# EAGLE design piezo-preamp-tickler_V3-4_single-supply-OPA1642_Labels (EAGLE 8.5.0)

## Sheet 1 of 2
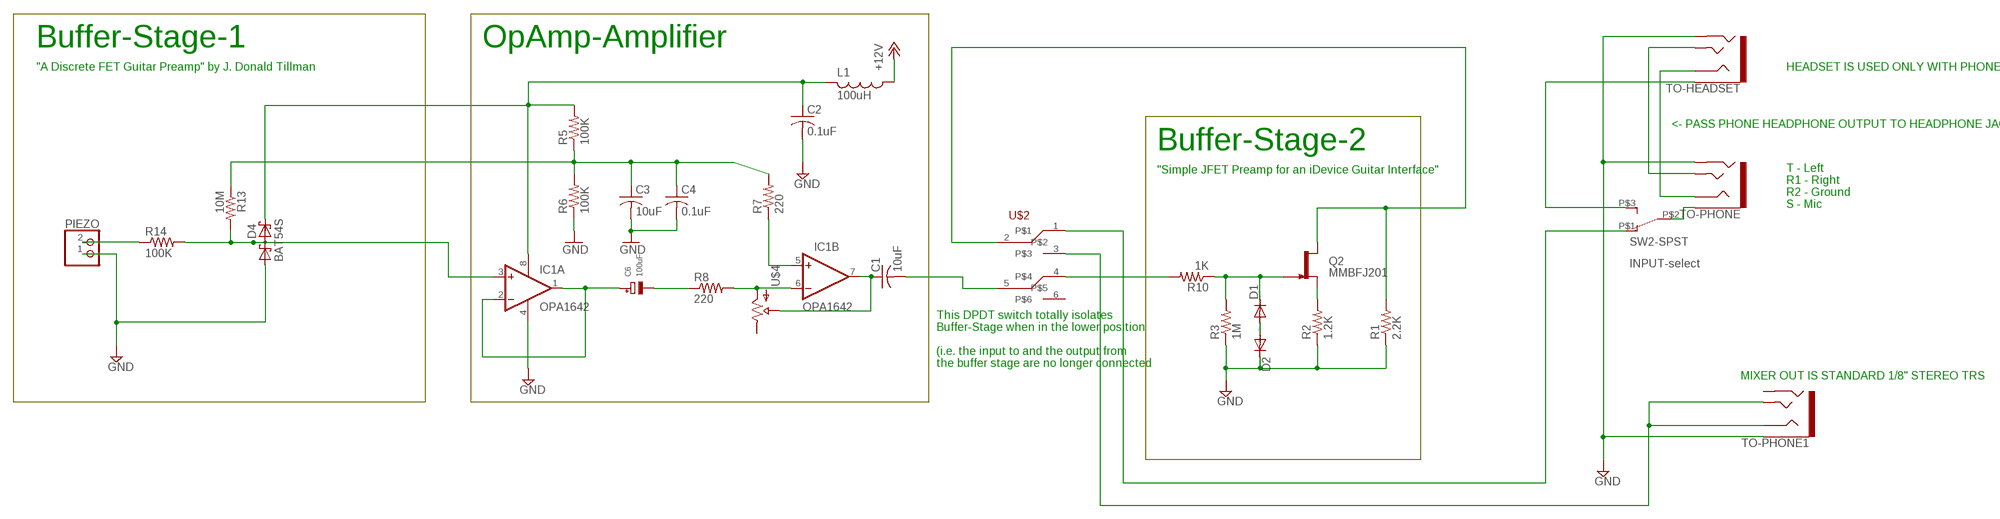
[diagram p0: schematic, sheet 1]

### Parts
C1  10uF  C-USC0603  [C0603]
C2  0.1uF  C-USC0805K  [C0805K]
C3  10uF  C-USC0805K  [C0805K]
C4  0.1uF  C-USC0805K  [C0805K]
C6  100uF  CAP_TANTALUMA/3216_REFLOW  [EIA3216-18/A-R]
D1  DIODE-SOD123  [SOD123]
D2  DIODE-SOD123  [SOD123]
D4  BAT54S  [SOT23]
IC1  OPA1642  OPA2134UA  [SO08]
L1  100uH  L-USL3225P  [L3225P]
PIEZO  JST_2PIN-THM  [JST-PH-2-THM]
Q2  MMBFJ201  J201SOT-23  [SOT23-3]
R1  2.2K  R-US_R0603  [R0603]
R2  1.2K  R-US_R0603  [R0603]
R3  1M  R-US_R0603  [R0603]
R5  100K  R-US_R0603  [R0603]
R6  100K  R-US_R0603  [R0603]
R7  220  R-US_R0603  [R0603]
R8  220  R-US_R0603  [R0603]
R10  1K  R-US_R0603  [R0603]
R13  10M  R-US_R0603  [R0603]
R14  100K  R-US_R0603  [R0603]
SW2-SPST  INPUT-select  SWITCH_SPDTCL-SB-12B  [SWITCH_SPDT_CL-SB-12B]
TO-HEADSET  AUDIO-JACK3LGPADS  [AUDIO-JACK-TRRS-SMD]
TO-PHONE  AUDIO-JACK3LGPADS  [AUDIO-JACK-TRRS-SMD]
TO-PHONE1  AUDIO-JACK3LGPADS  [AUDIO-JACK-TRRS-SMD]
U$2  SWITCH_DPDT  [SWITCH_DPDT_CL-SB-22B]
U$4  POTPOT-THUMB-ALPHA  [POT-THUMB-14MM_ALPHA-RV100F-30-4K1B-B10K-B301]

### Nets
+12V: L1.1 ; also sheet 2
GND: C2.2 C3.2 C4.2 D2.C D4.1(A1) IC1.4(A:V-) PIEZO.1 R1.1 R2.1 R3.1 R6.1 TO-HEADSET.RING2 TO-PHONE1.EARTH TO-PHONE.RING2 ; also sheet 2
N$1: D1.A D2.A
N$2: PIEZO.2 R14.1
N$3: Q2.2(S) R2.2
N$4: TO-HEADSET.EARTH
N$5: IC1.5(B:+IN) R7.1
N$6: C1.1 IC1.7(B:OUT) U$4.P$3(WIPER)
N$7: IC1.6(B:-IN) R8.2 U$4.P$1(IN)
N$9: D4.3(C1A2) IC1.3(A:+IN) R13.2 R14.2
N$10: D1.C Q2.3(G) R3.2 R10.1
N$11: R10.2 U$2.4
N$12: TO-PHONE1.RING1 TO-PHONE1.TIP U$2.3
N$13: TO-HEADSET.TIP TO-PHONE.TIP
N$14: C6.- R8.1
N$15: TO-HEADSET.RING1 TO-PHONE.RING1
N$16: C1.2 U$2.5
N$17: SW2-SPST.P$2 TO-PHONE.EARTH
N$19: SW2-SPST.P$1 U$2.1
N$23: C3.1 C4.1 R5.1 R6.2 R7.2 R13.1
N$24: C6.+ IC1.1(A:OUT) IC1.2(A:-IN)
N$25: C2.1 D4.2(C2) IC1.8(A:V+) L1.2 R5.2
SELECT: Q2.1(D) R1.2 U$2.2
Unconnected: SW2-SPST.P$3 TO-PHONE1.RING2 U$2.6 U$4.P$2(OUT)

### Notes on the sheet
- Buffer-Stage-1 | OpAmp-Amplifier
- "A Discrete FET Guitar Preamp" by J. Donald Tillman | HEADSET IS USED ONLY WITH PHONE
- <- PASS PHONE HEADPHONE OUTPUT TO HEADPHONE JACK
- Buffer-Stage-2
- "Simple JFET Preamp for an iDevice Guitar Interface"
- T - Left
  R1 - Right
  R2 - Ground
  S - Mic
- This DPDT switch totally isolates 
  Buffer-Stage when in the lower position
  
  (i.e. the input to and the output from 
  the buffer stage are no longer connected
- MIXER OUT IS STANDARD 1/8" STEREO TRS

## Sheet 2 of 2
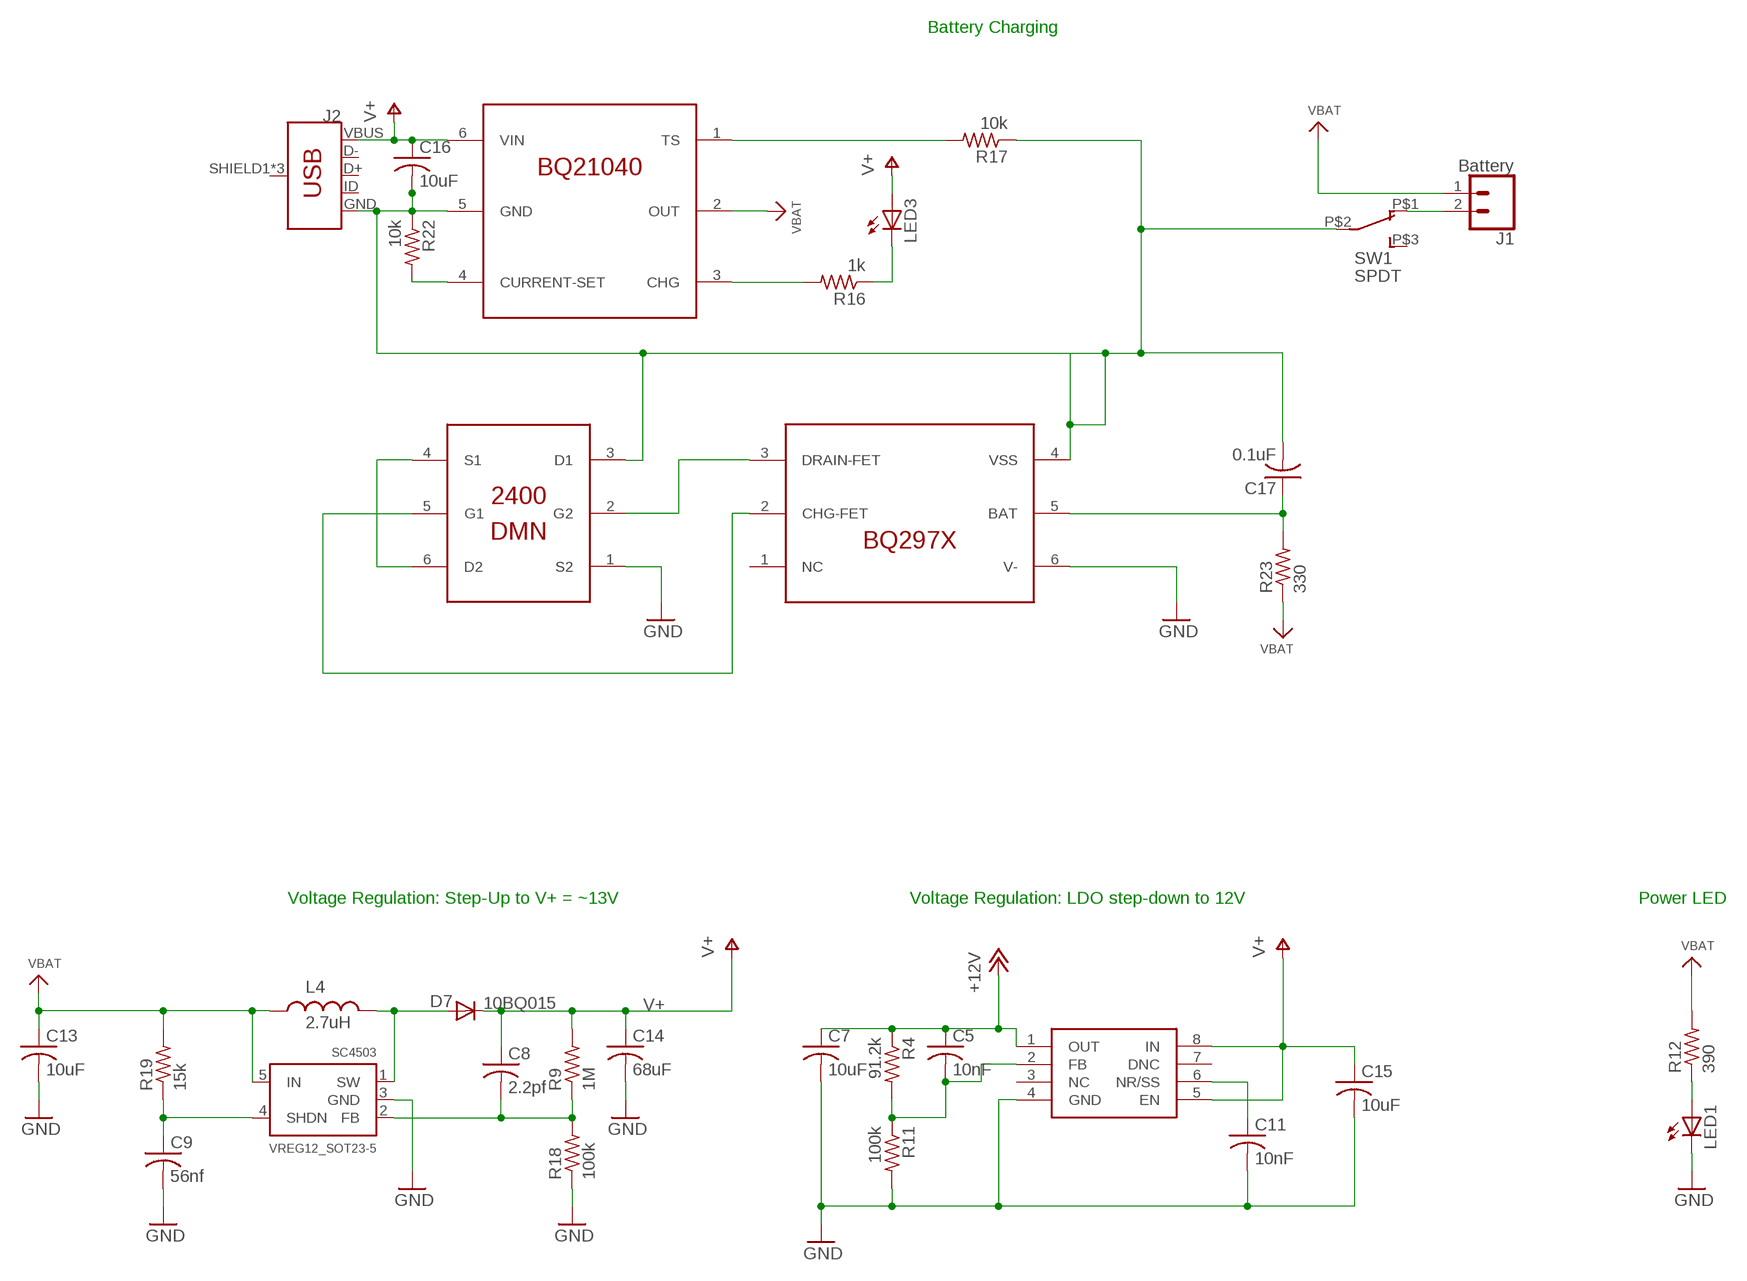
[diagram p1: schematic, sheet 2]

### Parts
C5  10nF  C-USC0603  [C0603]
C7  10uF  C-USC0603  [C0603]
C8  2.2pf  C-USC0805  [C0805]
C9  56nf  C-USC0805  [C0805]
C11  10nF  C-USC0603  [C0603]
C13  10uF  C-USC0805  [C0805]
C14  68uF  C-USC0805  [C0805]
C15  10uF  C-USC0603  [C0603]
C16  10uF  C-USC0805K  [C0805K]
C17  0.1uF  C-USC0805K  [C0805K]
D7  10BQ015  DIODESMA  [SMA-DIODE]
J1  Battery  CONN_02LOCK  [1X02_LOCK]
J2  USB_MICRO-BREDUCED_PASTE  [USB-B-MICRO-SMD_RED_PASTE]
L4  2.7uH  INDUCTORCR54  [CR54]
LED1  LED3MM  [LED3MM]
LED3  LED3MM  [LED3MM]
Q1  BQ21040  BQ21040-LIPO-CHARGER  [SOT23-6]
Q5  BQ297X  BQ297X-BATTERY-MANAGER  [WSON-6]
Q7  DMN2400  DUAL-NFET-DMN2400  [SOT-563]
R4  91.2k  R-US_R0603  [R0603]
R9  1M  R-US_R0603  [R0603]
R11  100k  R-US_R0603  [R0603]
R12  390  R-US_R0805  [R0805]
R16  1k  R-US_R0805  [R0805]
R17  10k  R-US_R0805  [R0805]
R18  100k  R-US_R0603  [R0603]
R19  15k  R-US_R0603  [R0603]
R22  10k  R-US_R0805  [R0805]
R23  330  R-US_R0805  [R0805]
SC4503  VREG12_SOT23-5  [SOT23-5]
SW1  SPDT  SWITCH_SPDTCL-SB-12B  [SWITCH_SPDT_CL-SB-12B]
U$5  TPS7A49  [MSOP-8]

### Nets
+12V: C5.1 C7.1 R4.1 U$5.1(OUT) ; also sheet 1
GND: C7.2 C9.2 C11.2 C13.2 C14.2 C15.2 LED1.K(C) Q5.6(V-) Q7.1(S2) R11.2 R18.1 SC4503.3(GND) U$5.4(GND) ; also sheet 1
GND2: C16.2 C17.2 J2.GND Q1.5(GND) Q5.4(VSS) Q7.3(D1) R17.1 R22.1 SW1.P$2
N$18: LED1.A R12.1
N$20: J1.2 SW1.P$1
N$22: LED3.K(C) R16.1
N$26: C5.2 R4.2 R11.1 U$5.2(FB)
N$27: Q1.3(CHG) R16.2
N$28: C11.1 U$5.6(NR/SS)
N$29: C9.1 R19.1 SC4503.4(SHDN)
N$30: C8.2 R9.1 R18.2 SC4503.2(FB)
N$31: Q1.1(TS) R17.2
N$32: D7.A L4.P$2 SC4503.1(SW)
N$36: Q1.4(CURRENT-SET) R22.2
N$42: C17.1 Q5.5(BAT) R23.2
N$43: Q7.4(S1) Q7.6(D2)
N$44: Q5.2(CHG-FET) Q7.5(G1)
N$45: Q5.3(DRAIN-FET) Q7.2(G2)
V+: C8.1 C14.1 C15.1 C16.1 D7.C J2.VBUS LED3.A Q1.6(VIN) R9.2 U$5.5(EN) U$5.8(IN)
VBAT: C13.1 J1.1 L4.P$1 Q1.2(OUT) R12.2 R19.2 R23.1 SC4503.5(IN)
Unconnected: J2.D+ J2.D- J2.ID J2.SHIELD1(SHIELD) J2.SHIELD2(SHIELD) J2.SHIELD3(SHIELD) Q5.1(NC) SW1.P$3 U$5.3(NC) U$5.7(DNC)

### Notes on the sheet
- Battery Charging
- Voltage Regulation: Step-Up to V+ = ~13V | Voltage Regulation: LDO step-down to 12V | Power LED

## Library data of the parts
C1-C5 C7-C9 C11 C13-C17 = adafruit:C-US: CAPACITOR, American symbol
C6 = microbuilder:CAP_TANTALUM: Tantalum Capacitors Wave footprints have larger pads and are meant to be used for hand soldering. Reflow footprints are optimised for solder paste and a reflow oven. EIA3216-18/A-[R/W] - Size A / 3216-18 / 1206 footprint 4.7µF 25V 10% Tantalum Capacitor 10µF 16V 10% Tantalum Capacitor [Digikey: 495-2236-2-ND] EIA3528-21/B-[R/W] - Size B / 3528-21 47µF 10V 10% Tantalum Capactior [Digikey: 495-2216-1-ND] EIA6032-28/C-[R/W] - Size C / 6032-28 10µF 35V 20% Tantalum Capacitor [Digikey: 495-2285-1-ND] 100µF 16V 10% Tantalum Capactior [Digikey: 399-5214-1-ND]
D1 D2 = diode:DIODE-: DIODE
D4 = diode:BAT54S: Schottky Diodes Pin connection corrected 2011-05-04 Source: Fairchild .. BAT54.pdf
D7 = SparkFun:DIODE: Diode These are standard reverse protection diodes and small signal diodes. SMA package can handle up to about 1A. SOD-323 can handle about 200mA. What the SOD-323 package when ordering, there are some mfgs out there that are 5-pin packages.
IC1 = linear:OPA2*: Dual Operational Amplifier Low Power, Single-Supply, Rail-To-Rail Operational Amplifier Source: http://focus.ti.com/lit/ds/symlink/opa2345.pdf http://focus.ti.com .. opa241.pdf http://focus.ti.com/lit/ds/symlink/opa2134.pdf
J1 = SparkFun-Connectors:CONN_02: Multi connection point. Often used as Generic Header-pin footprint for 0.1 inch spaced/style header connections On any of the 0.1 inch spaced packages, you can populate with these: Break Away Headers - Straight <https://www.sparkfun.com/products/116> (PRT-00116) Break Away Male Headers - Right Angle <https://www.sparkfun.com/products/553> (PRT-00553) Female Headers <https://www.sparkfun.com/products/115> (PRT-00115) Break Away Headers - Machine Pin <https://www.sparkfun.com/products/117> (PRT-00117) Break Away Female Headers - Swiss Machine Pin <https://www.sparkfun.com/products/743> (PRT-00743) For SCREWTERMINALS and SPRING TERMINALS visit here: Screw Terimnals on SparkFun.com <https://www.sparkfun.com/search/results?term=Screw+Terminals> (5mm/3.5mm/2.54mm spacing) This device is also useful as a general connection point to wire up your design to another part of your project. Our various solder wires solder well into these plated through hole pads. Hook-Up Wire - Assortment (Stranded, 22 AWG) <https://www.sparkfun.com/products/11375> (PRT-11375) Hook-Up Wire - Assortment (Solid Core, 22 AWG) <https://www.sparkfun.com/products/11367> (PRT-11367) View the entire wire category on our website here <https://www.sparkfun.com/categories/141> Special notes: Molex polarized connector foot print use with: PRT-08233 with associated crimp pins and housings. 2.54_SCREWTERM for use with PRT-10571. 3.5mm Screw Terminal footprints for PRT-08084 5mm Screw Terminal footprints for use with PRT-08432
J2 = SparkFun-Connectors:USB_MICRO-B: USB Type Micro-B Connector Male/female and PTH/SMT variants SparkFun Products: SparkFun microB USB Breakout <https://www.sparkfun.com/products/12035> SparkFun USB microB Plug Breakout <https://www.sparkfun.com/products/10031> SparkFun ESP8266 Thing <https://www.sparkfun.com/products/13231>; PROD_ID: CONN-11752
L1 = rcl:L-US: INDUCTOR, American symbol; SPICEPREFIX: L
L4 = SparkFun:INDUCTOR: Inductors Basic Inductor/Choke - 0603 and 1206. Footprints are not proven and vary greatly between part numbers.
LED1 LED3 = led:LED: LED OSRAM: - CHIPLED LG R971, LG N971, LY N971, LG Q971, LY Q971, LO R971, LY R971 LH N974, LH R974 LS Q976, LO Q976, LY Q976 LO Q996 - Hyper CHIPLED LW Q18S LB Q993, LB Q99A, LB R99A - SideLED LS A670, LO A670, LY A670, LG A670, LP A670 LB A673, LV A673, LT A673, LW A673 LH A674 LY A675 LS A676, LA A676, LO A676, LY A676, LW A676 LS A679, LY A679, LG A679 - Hyper Micro SIDELED® LS Y876, LA Y876, LO Y876, LY Y876 LT Y87S - SmartLED LW L88C, LW L88S LB L89C, LB L89S, LG L890 LS L89K, LO L89K, LY L89K LS L896, LA L896, LO L896, LY L896 - TOPLED LS T670, LO T670, LY T670, LG T670, LP T670 LSG T670, LSP T670, LSY T670, LOP T670, LYG T670 LG T671, LOG T671, LSG T671 LB T673, LV T673, LT T673, LW T673 LH T674 LS T676, LA T676, LO T676, LY T676, LB T676, LH T676, LSB T676, LW T676 LB T67C, LV T67C, LT T67C, LS T67K, LO T67K, LY T67K, LW E67C LS E67B, LA E67B, LO E67B, LY E67B, LB E67C, LV E67C, LT E67C LW T67C LS T679, LY T679, LG T679 LS T770, LO T770, LY T770, LG T770, LP T770 LB T773, LV T773, LT T773, LW T773 LH T774 LS E675, LA E675, LY E675, LS T675 LS T776, LA T776, LO T776, LY T776, LB T776 LHGB T686 LT T68C, LB T68C - Hyper Mini TOPLED® LB M676 - Mini TOPLED Santana® LG M470 LS M47K, LO M47K, LY M47K Source: http://www.osram.convergy.de LUXEON: - LUMILED® LXK2-PW12-R00, LXK2-PW12-S00, LXK2-PW14-U00, LXK2-PW14-V00 LXK2-PM12-R00, LXK2-PM12-S00, LXK2-PM14-U00 LXK2-PE12-Q00, LXK2-PE12-R00, LXK2-PE12-S00, LXK2-PE14-T00, LXK2-PE14-U00 LXK2-PB12-K00, LXK2-PB12-L00, LXK2-PB12-M00, LXK2-PB14-N00, LXK2-PB14-P00, LXK2-PB14-Q00 LXK2-PR12-L00, LXK2-PR12-M00, LXK2-PR14-Q00, LXK2-PR14-R00 LXK2-PD12-Q00, LXK2-PD12-R00, LXK2-PD12-S00 LXK2-PH12-R00, LXK2-PH12-S00 LXK2-PL12-P00, LXK2-PL12-Q00, LXK2-PL12-R00 Source: www.luxeon.com KINGBRIGHT: KA-3528ASYC Source: www.kingbright.com
PIEZO = adafruit:JST_2PIN: JST 2-Pin Connectors of various flavors SMT-RA (S2B-PH-SM4) 4UConnector #17311 SMT (B2B-PH-SM4) THM-RA (S2B-PH) THM (B2B-PH)
Q1 = CMU-ArtFab:BQ21040-LIPO-CHARGER
Q2 = CMU-ArtFab:J201: N-channel JFET
Q5 = CMU-ArtFab:BQ297X-BATTERY-MANAGER
Q7 = CMU-ArtFab:DUAL-NFET-DMN2400
R1-R14 R16-R19 R22 R23 = CMU-ArtFab:R-US_: RESISTOR, American symbol
SC4503 = CMU-ArtFab:VREG12_SOT23-5: SOT23-5 Fixed Voltage Regulators To better organise some of the SOT23-5 fixed voltage regulators in this library, this new part was created. Part Current Out V Out V In V Dropout Digikey Part No. ADP121 150mA 3.3V 3.4-5.5V 0.09V @ 150mA ADP121-AUJZ33R7CT-ND ADP121 150mA 3.0V 3.1-5.5V 0.09V @ 150mA ADP121-AUJZ30R7CT-ND ADP122 300mA 3.3V 3.4-5.5V 0.085V @ 300mA ADP122AUJZ-3.3-R7CT-ND ADP1712 300mA 3.3V 3.5-5.5V 0.17V @ 300mA ADP1712AUJZ-3.3-R7TR-ND AP7311 (Low Cost) 150mA 3.3V 3.5-6V 0.15V @ 150mA AP7311-33WG-7DICT-ND LD39015M18R 150mA 1.8V 1.9V-5.5V 0.08V @ 100mA 497-6977-1-ND MCP1824T-3302E/OT 300mA 3.3V 3.5V-6V 0.2V @ 300mA MCP1824T-3302E/OTCT-ND MIC5205-2.5YM5 TR 150mA 2.5V 2.7-16V 0.165V @ 150mA 576-1257-2-ND MIC5205-3.0YM5 TR 150mA 3.0V 3.2V-16V 0.165V @ 150mA 576-1258-2-ND MIC5205-3.3YM5 TR 150mA 3.3V 3.5V-16V 0.165V @ 150mA 576-1259-2-ND TPS780330220 150mA 3.3V+2.2V 3.6-5.5V 250mV Max 296-23332-1-ND TDA3663/N1,135 100mA 3.3V 3.5-45V 0.18V @ 50mA 568-5343-1-ND
SW1 SW2-SPST = CMU-ArtFab:SWITCH_SPDT
TO-HEADSET TO-PHONE TO-PHONE1 = Daniel:AUDIO-JACK3: Audio jack - 3.5mm TRRS variety - two rings.
U$2 = CMU-ArtFab:SWITCH_DPDT
U$4 = CMU-ArtFab:POT: http://www.taydaelectronics.com/10k-ohm-linear-taper-potentiometer-round-shaft-pcb-9mm.html http://www.taydaelectronics.com/datasheets/A-1847.pdf
U$5 = CMU-ArtFab:TPS7A49

## Board
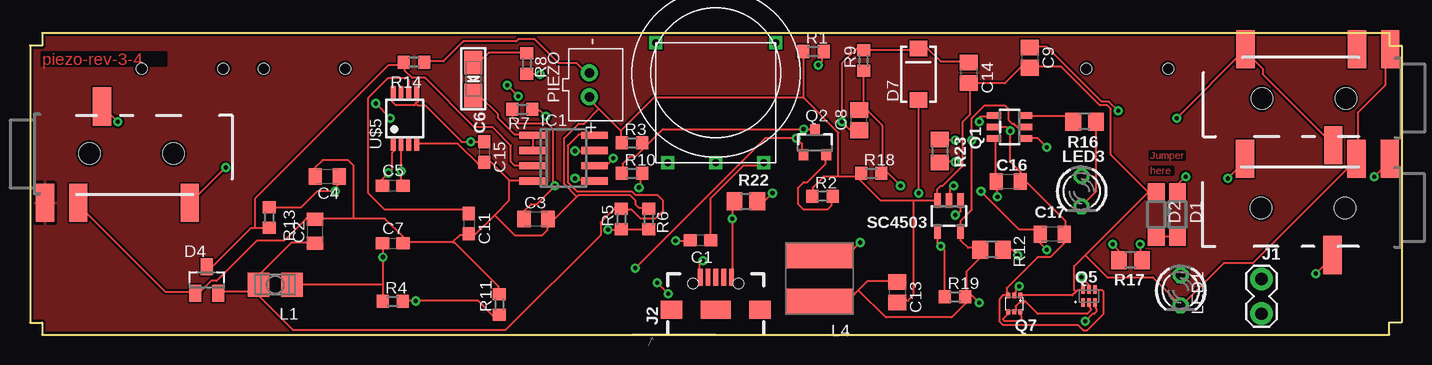
[diagram p2: board, top side]
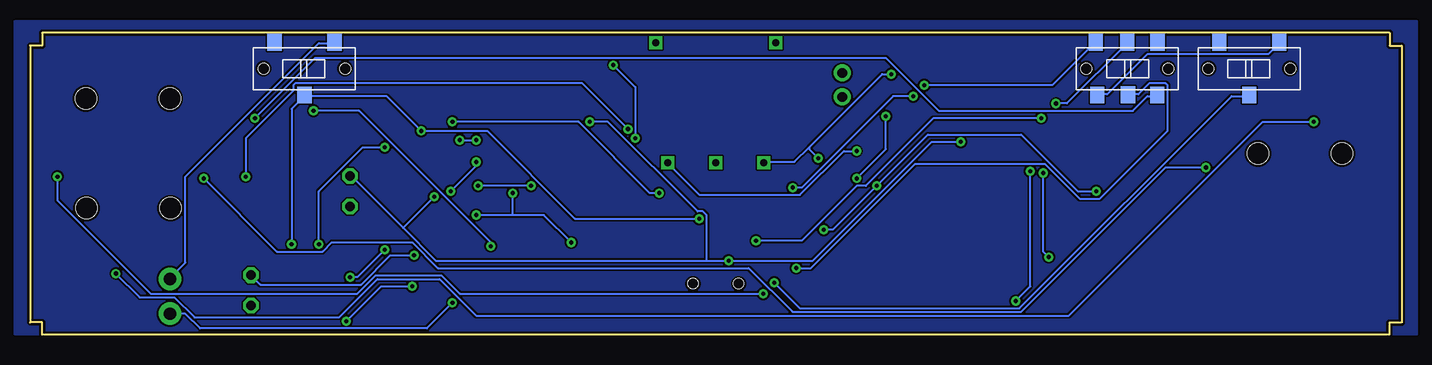
[diagram p3: board, bottom side, seen from below]

Size 114.3 x 25.15 mm. Coordinates in mm from the lower left corner, seen from the top.
Outline: 0,24.08 0,1 1.02,1 1.02,0 113.28,0 113.28,1.02 114.3,1.02 114.3,24.08 113.28,24.08 113.28,25.15 1,25.15 1,24.08 0,24.08
Copper layers (1*16): Top 0.035mm / dielectric 1.5mm / Bottom 0.035mm
Design rules "default *": minimum track width 6mil, minimum drill 0.35mm, track to track 6mil, track to pad 6mil, pad to pad 6mil, via to via 6mil, smd to smd 6mil, copper to edge 8mil, drill to drill 6mil, minimum pad ring 10mil, minimum via ring 8mil, stop-mask expansion 4mil, vias tented up to drill 20mil, thermal gap 10mil

### Footprints (pad centres in the part's own frame; a part is rotated, then mirrored left to right if it is on the bottom)
C0603 = smd 1.1 x 1: 1 -0.85,0; 2 0.85,0
C0805K = smd 1.1 x 1.4: 1 -1,0; 2 1,0
EIA3216-18/A-R = smd 1.95 x 1.5: + 1.375,0; - -1.375,0
C0805 = smd 1.3 x 1.5: 1 -0.85,0; 2 0.85,0
SOD123 = smd 1.4 x 1.4: A 1.9,0; C -1.9,0
SOT23 = smd 1 x 1.4: 1 -0.95,-1.1; 2 0.95,-1.1; 3 0,1.1
SMA-DIODE = smd 1.27 x 1.47: A -2.15,0; C 2.15,0
SO08 = smd 0.6 x 2.2: 1 -1.905,-2.6; 2 -0.635,-2.6; 3 0.635,-2.6; 4 1.905,-2.6; 5 1.905,2.6; 6 0.635,2.6; 7 -0.635,2.6; 8 -1.905,2.6
1X02_LOCK = drill 1.016 pad 1.88: 1 -0.178,0; 2 2.718,0
USB-B-MICRO-SMD_RED_PASTE = smd 1.45 x 0.4: D+ 2.725,0; D- 2.725,0.65; GND 2.725,-1.3; ID 2.725,-0.65; VBUS 2.725,1.3 | smd 1.5 x 1.8: SHIELD1 0,3.685; SHIELD2 0,-3.685 | smd 1.5 x 2.5: SHIELD3 0,0 | hole 0.85: 2.2,1.9; 2.2,-1.9
L3225P = smd 1.8 x 2: 1 -1.4,0; 2 1.4,0
CR54 = smd 5.5 x 2.15: P$1 0,1.92; P$2 0,-1.92
LED3MM = drill 0.813 octagon: A -1.27,0; K 1.27,0
JST-PH-2-THM = drill 0.8 pad 1.422: 1 1,0; 2 -1,0
SOT23-6 = smd 0.55 x 1.2: 1 -0.95,-1.3; 2 0,-1.3; 3 0.95,-1.3; 4 0.95,1.3; 5 0,1.3; 6 -0.95,1.3
SOT23-3 = smd 0.8 x 0.9: 1 -0.95,-1; 2 0.95,-1; 3 0,1.1
WSON-6 = smd 0.3 x 0.7: 1 -0.5,-0.55; 2 0,-0.55; 3 0.5,-0.55; 4 0.5,0.55; 5 0,0.55; 6 -0.5,0.55
SOT-563 = smd 0.3 x 0.45: 1 -0.5,-0.675; 2 0,-0.675; 3 0.5,-0.675; 4 0.5,0.675; 5 0,0.675; 6 -0.5,0.675
R0603 = smd 1 x 1.1: 1 -0.85,0; 2 0.85,0
R0805 = smd 1.3 x 1.5: 1 -0.95,0; 2 0.95,0
SOT23-5 = smd 0.55 x 1.2: 1 -0.95,-1.3; 2 0,-1.3; 3 0.95,-1.3; 4 0.95,1.3; 5 -0.95,1.3
SWITCH_SPDT_CL-SB-12B = smd 1.2 x 1.4: P$1 -2.5,-2.2; P$2 0,2.2; P$3 2.5,-2.2 | hole 0.9: -3.4,0; 3.4,0
AUDIO-JACK-TRRS-SMD = smd 1.524 x 3.175: EARTH -2.114,-5.271; RING1 2.644,2.759; RING2 0.66,-5.271; TIP 9.948,-5.271 | hole 1.778: 1.6,-1.15; 8.6,-1.15
SWITCH_DPDT_CL-SB-22B = smd 1.2 x 1.4: 1 -2.5,-2.2; 2 0.05,-2.17; 3 2.5,-2.2; 4 -2.63,2.2; 5 0,2.2; 6 2.51,2.2 | hole 0.9: -3.4,0; 3.4,0
POT-THUMB-14MM_ALPHA-RV100F-30-4K1B-B10K-B301 = drill 0.6 square: P$1 -4,-7.5; P$2 0,-7.5; P$3 4,-7.5; P$4 -5,2.5; P$5 5,2.5
MSOP-8 = smd 0.4 x 1: 1 -0.975,-2.2; 2 -0.325,-2.2; 3 0.325,-2.2; 4 0.975,-2.2; 5 0.975,2.2; 6 0.325,2.2; 7 -0.325,2.2; 8 -0.975,2.2

### Placement (x,y rotation side)
C1  55.88,7.84 180 top
C2  23.75,8.6 90 top
C3  42.16,9.62 0 top
C4  24.77,13.18 180 top
C5  30.23,12.41 0 top
C6  36.96,21.3 270 top
C7  30.23,7.59 0 top
C8  69.09,17.88 90 top
C9  83.31,23.08 270 top
C11  36.58,9.24 270 top
C13  72.26,3.52 270 top
C14  78.23,21.81 270 top
C15  37.85,15.21 270 top
C16  81.53,12.75 0 top
C17  85.2,8.36 0 top
D1  95.63,10 270 top
D2  93.85,10 270 top
D4  14.73,4.54 0 top
D7  74.04,21.69 90 top
IC1  44.45,14.7 270 top
J1  102.63,1.92 90 top
J2  57.15,2.04 90 top
L1  20.45,4.16 180 top
L4  65.79,4.67 180 top
LED1  95.89,3.68 270 top
LED3  87.63,11.94 270 top
PIEZO  46.61,20.8 270 top
Q1  81.64,17.3 90 top
Q2  65.41,15.97 0 top
Q5  88.25,3.21 0 top
Q7  82.02,2.57 180 top
R1  65.28,23.59 0 top
R2  66.04,11.53 0 top
R3  50.16,15.97 0 top
R4  30.23,2.76 0 top
R5  49.28,9.62 90 top
R6  51.56,9.62 270 top
R7  41.02,18.76 180 top
R8  41.4,22.57 270 top
R9  69.47,22.83 90 top
R10  50.16,13.43 0 top
R11  39.12,2.51 90 top
R12  80.14,7.08 180 top
R13  19.94,9.75 270 top
R14  32,22.7 180 top
R16  87.89,17.74 180 top
R17  91.7,6.2 180 top
R18  70.1,13.43 0 top
R19  77.09,3.14 0 top
R22  59.65,11.11 0 top
R23  75.81,15.29 270 top
SC4503  76.58,9.87 180 top
SW1  91.44,22.16 180 bottom
SW2-SPST  12.7,22.16 180 bottom
TO-HEADSET  3.37,16.24 0 top
TO-PHONE  111.19,9.38 180 top
TO-PHONE1  111.25,18.52 180 top
U$2  22.86,22.16 0 bottom
U$4  57.15,21.81 0 top
U$5  31.24,18 0 top

### Tracks (layer width: path | path; a pad name or v marks a point on that pad's centre or on a via)
+12V  (via drill 0.35)
  Top 0.152: U$5.1 30.33,15.75 30.33,15.29 30.18,15.14 30.18,13.77 v29.87,13.46 29.26,12.85 29.26,12.55 C5.1 | 29.41,4.17 v29.41,6.45 29.41,7.52 C7.1 | 29.41,4.17 29.41,2.79 R4.1 | 29.41,4.17 21.95,4.17 L1.1
  Bottom 0.152: v29.87,13.46 29.87,6.91 v29.41,6.45
GND
  Top 0.152: TO-HEADSET.RING2 3.96,10.87 11.28,3.56 13.72,3.56 D4.1 13.87,3.56 14.17,3.56 15.09,4.47 15.54,4.47 18.9,7.82 21.18,7.82 23.01,9.65 23.62,9.65 C2.2 23.77,9.65 26.98,9.65 | 49.23,16.97 49.23,16.05 R3.1 | 47.4,18.8 46.48,19.71 PIEZO.1 | 47.4,18.8 49.23,16.97 | 45.57,11.48 43.74,9.65 43.28,9.65 C3.2 43.13,9.5 43.13,8.74 42.67,8.28 40.39,8.28 38.71,9.96 | 45.57,11.48 45.72,11.63 49.99,11.63 50.44,11.18 50.44,10.87 50.75,10.57 51.51,10.57 R6.1 | 47.4,18.8 46.18,17.58 45.72,17.58 44.5,16.36 44.5,12.55 45.57,11.48 | U$5.4 32.31,15.9 35.66,15.9 37.34,14.22 37.8,14.22 C15.2 37.95,14.38 38.41,14.38 39.93,12.85 | 39.93,12.85 41.76,12.85 IC1.4 | 35.2,7.67 31.09,7.67 | 35.2,7.67 35.81,8.28 36.58,8.28 | 35.2,7.67 35.36,7.67 39.01,4.01 39.01,3.4 R11.2 | 26.98,9.65 29.57,9.65 31.09,8.13 31.09,7.67 | 31.09,7.67 C7.2 | 26.98,9.65 26.98,14.07 26.52,14.53 24.38,14.53 23.77,13.92 23.77,13.31 C4.2 | 39.93,12.85 39.93,11.18 38.71,9.96 | 38.71,9.96 37.03,8.28 36.58,8.28 | 36.58,8.28 C11.2 | 78.33,20.93 81.23,20.93 82.6,22.3 83.21,22.3 C9.2 83.36,22.3 85.95,22.3 89.15,19.1 89.76,19.1 90.07,18.8 90.07,14.99 93.12,11.94 93.27,11.94 93.42,11.79 | 68.89,13.16 69.04,13.16 69.19,13.31 R18.1 68.89,13.16 | 68.89,13.16 67.36,13.16 | 67.36,13.16 66.14,13.16 65.23,12.24 65.23,11.63 R2.1 | 64.47,19.71 64.47,23.52 R1.1 | 64.47,19.71 67.36,16.81 67.36,13.16 | 73.61,11.18 70.87,11.18 68.89,13.16 | 73.61,11.18 75.59,11.18 | 73.61,11.18 73.61,3.25 73.15,2.79 72.39,2.79 C13.2 | 78.33,20.93 78.33,18.34 77.72,17.73 77.72,14.07 76.05,12.39 75.89,12.39 75.59,12.09 75.59,11.18 | 78.33,20.93 C14.2 | 75.59,11.18 SC4503.3
  Top 0.152: TO-PHONE1.EARTH 113.23,23.67 112.93,23.37 112.93,20.78 110.64,18.49 110.64,14.68 TO-PHONE.RING2 110.49,14.53 101.96,5.99 99.52,5.99 96.01,2.49 LED1.K 95.86,2.49 93.57,4.78 89.76,4.78 87.94,6.6 | 87.17,3.56 87.33,3.71 87.63,3.71 Q5.6 | 87.17,3.56 86.87,3.25 82.6,3.25 Q7.1 | 93.42,11.79 93.12,11.79 87.94,6.6 | 93.42,11.79 93.73,11.79 D2.C 93.42,11.79 | 87.94,6.6 87.02,5.69 87.02,3.71 87.17,3.56 | 49.23,16.97 51.97,19.71 64.47,19.71
GND2  (via drill 0.35)
  Top 0.152: Q5.4 88.85,3.71 89.31,3.71 89.46,3.56 89.46,1.73 88.09,0.36 87.78,0.36 87.33,0.81 81.08,0.81 80.77,1.12 80.77,2.95 81.08,3.25 81.38,3.25 Q7.3 81.53,3.25 81.53,3.4 81.38,3.56 81.38,3.86 83.97,6.45 85.04,6.45 86.26,7.67 86.26,8.28 C17.2 86.26,8.43 86.26,9.5 83.06,12.7 82.6,12.7 C16.2 82.6,12.85 82.6,13.46 81.69,14.38 v81.69,16.97 81.38,17.27 80.47,17.27 Q1.5 | J2.GND 58.52,4.78 v58.52,9.65 58.52,10.87 58.67,11.02 R22.1 | v92.51,7.52 92.51,6.3 R17.1
  Bottom 0.152: 91.44,19.86 84.58,19.86 v81.69,16.97 76.2,16.97 68.89,9.65 v58.52,9.65 | v92.51,7.52 92.51,18.8 91.44,19.86 | 91.44,19.86 SW1.P$2
N$1
  Top 0.152: D2.A 93.88,8.13 95.56,8.13 D1.A
N$2
  Top 0.152: R14.1 32.92,22.76 34.44,22.76 36.12,24.44 40.54,24.44 40.69,24.59 42.06,24.59 44.04,22.61 45.57,22.61 46.48,21.69 PIEZO.2
N$3
  Top 0.152: Q2.2 66.29,14.83 66.29,14.22 64.77,12.7 64.47,12.7 64.01,12.24 64.01,10.87 64.47,10.41 66.45,10.41 66.75,10.72 66.75,11.48 R2.2
N$4
  pour Top: -1.27,26.13 -1.27,0 115.57,0 115.57,26.13
N$5  (via drill 0.35)
  Top 0.152: v42.98,18.19 42.52,18.64 41.91,18.64 R7.1 | v45.41,13 45.57,12.85 46.94,12.85 IC1.5
  Bottom 0.152: v42.98,18.19 42.98,15.44 v45.41,13
N$6  (via drill 0.35)
  Top 0.152: C1.1 56.69,7.98 56.69,11.33 59.44,14.07 60.96,14.07 61.11,14.22 U$4.P$3 | v45.41,15.29 46.94,15.29 IC1.7
  Bottom 0.152: v45.41,15.29 46.48,15.29 50.14,11.63 58.52,11.63 61.11,14.22 U$4.P$3
N$7  (via drill 0.35)
  Top 0.152: v42.52,21.69 41.45,21.69 R8.2 | v48.62,14.68 48.01,14.07 47.09,14.07 IC1.6
  Bottom 0.152: v42.52,21.69 43.28,21.69 49.38,15.6 | 49.38,15.6 50.6,14.38 53.03,14.38 U$4.P$1 | v48.62,14.68 49.38,15.44 49.38,15.6
N$8
  pour Bottom: -1.27,26.13 -1.27,0 115.57,0 115.57,26.13
N$9
  Top 0.152: 18.75,8.89 18.44,8.89 15.24,5.69 14.78,5.69 D4.3 | 18.75,8.89 19.81,8.89 R13.2 | 31.24,22.45 31.24,22 31.85,21.39 32.92,21.39 37.03,17.27 38.56,17.27 40.08,15.75 40.08,14.38 40.39,14.07 41.76,14.07 IC1.3 | 31.24,22.45 31.24,22.61 R14.2 31.24,22.45 | 18.75,8.89 18.75,11.33 29.87,22.45 31.24,22.45
N$10  (via drill 0.35)
  Top 0.152: 51.05,15.9 51.51,15.9 52.73,17.12 v64.47,17.12 65.38,17.12 Q2.3 | 51.05,15.9 51.05,15.44 50.44,14.83 49.99,14.83 49.38,14.22 49.38,13.46 R10.1 | 51.05,15.9 R3.2 | v96.32,13.16 95.71,12.55 95.71,11.94 D1.C
  Bottom 0.152: v96.32,13.16 96.32,16.36 92.35,20.32 92.35,20.78 92.2,20.93 68.28,20.93 v64.47,17.12
N$11  (via drill 0.35)
  Top 0.152: v50.75,12.24 50.9,12.39 50.9,13.31 R10.2 | v39.78,20.78 v40.69,19.86
  Bottom 0.152: v50.75,12.24 49.99,12.24 42.37,19.86 v40.69,19.86 | v39.78,20.78 29.11,20.78 25.6,24.28 U$2.4
N$12  (via drill 0.35)
  Top 0.152: 101.19,23.67 v95.56,18.03 | 101.19,23.67 102.72,22.15 102.72,21.69 108.51,15.9 TO-PHONE1.RING1 | 101.19,23.67 TO-PHONE1.TIP
  Bottom 0.152: v95.56,18.03 90.53,23.06 42.98,23.06 38.56,18.64 22.4,18.64 21.18,19.86 20.42,19.86 U$2.3
N$13  (via drill 0.35)
  Top 0.152: v16.31,13.92 13.41,11.02 TO-HEADSET.TIP | v99.82,13 101.35,14.53 TO-PHONE.TIP
  Bottom 0.152: v16.31,13.92 19.66,13.92 31.7,1.88 50.75,1.88 54.41,5.54 80.31,5.54 82.45,7.67 89.15,7.67 89.92,6.91 93.73,6.91 v99.82,13
N$14
  Top 0.152: R8.1 41.3,23.52 38.25,23.52 37.49,22.76 37.03,22.76 C6.-
N$15  (via drill 0.35)
  Top 0.152: v7.32,17.73 6.1,18.95 TO-HEADSET.RING1 | v107.14,5.08 108.66,6.6 TO-PHONE.RING1
  Bottom 0.152: v7.32,17.73 11.58,17.73 27.74,1.58 77.11,1.58 80.16,4.62 85.34,4.62 88.54,1.42 100.58,1.42 102.26,3.1 105.16,3.1 v107.14,5.08
N$16  (via drill 0.35)
  Top 0.152: v53.8,7.82 55.02,7.82 C1.2 | v28.8,19.25 v30.02,18.03
  Bottom 0.152: v53.8,7.82 49.99,7.82 45.41,12.39 44.65,12.39 39.01,18.03 v30.02,18.03 | v28.8,19.25 27.89,19.25 22.86,24.28 U$2.5
N$17  (via drill 0.35)
  Top 0.152: v53.19,3.4 v52.27,4.32 | v112.01,13.16 113.39,14.53 TO-PHONE.EARTH
  Bottom 0.152: v52.27,4.32 50.14,2.18 31.85,2.18 14.17,19.86 12.8,19.86 SW2-SPST.P$2 | v53.19,3.4 78.49,3.4 80.01,4.93 85.5,4.93 87.02,3.4 104.24,3.4 112.01,11.18 v112.01,13.16
N$18  (via drill 0.35)
  Top 0.152: v82.3,6.6 81.84,7.06 81.23,7.06 R12.1
  Bottom 0.152: v82.3,6.6 84.28,6.6 86.72,4.17 95.1,4.17 LED1.A
N$19
  Bottom 0.152: U$2.1 25.3,20.02 24.54,20.02 21.18,23.37 11.12,23.37 10.21,24.28 SW2-SPST.P$1
N$20
  Bottom 0.152: SW1.P$1 89,24.28 90.22,24.28 101.35,13.16 101.35,5.99 102.56,4.78 J1.2
N$22
  Top 0.152: R16.1 88.85,17.73 88.85,11.94 87.63,10.72 LED3.K
N$23  (via drill 0.35)
  Top 0.152: 25.3,12.09 25.76,12.55 25.76,13.16 C4.1 | 25.3,12.09 25.15,11.94 23.93,11.94 22.55,10.57 19.96,10.57 R13.1 | R6.2 51.51,8.74 49.38,8.74 R5.1 49.23,8.74 v48.16,8.74 | 43.59,12.39 43.59,12.24 42.22,10.87 41.76,10.87 41.15,10.26 41.15,9.65 C3.1 | 43.59,12.39 43.59,17.12 43.13,17.58 40.69,17.58 40.23,18.03 40.23,18.64 R7.2 | 43.59,12.39 v43.74,12.39 | v25.45,11.94 25.3,12.09
  Bottom 0.152: v48.16,8.74 47.4,8.74 v43.74,12.39 39.47,16.66 31.7,16.66 26.98,11.94 v25.45,11.94
N$24
  Top 0.152: C6.+ 37.03,19.86 37.49,19.86 39.01,18.34 39.01,18.03 40.39,16.66 41.76,16.66 IC1.1 41.91,16.51 41.91,15.44 IC1.2
N$25
  Top 0.152: 18.59,3.71 18.9,4.01 L1.2 | 18.59,3.71 18.44,3.56 15.7,3.56 D4.2 | C2.1 23.62,7.67 21.79,7.67 19.05,4.93 L1.2 | IC1.8 46.94,16.66 45.72,16.66 44.81,15.75 44.81,12.7 45.57,11.94 50.14,11.94 50.44,11.63 52.27,11.63 52.73,11.18 52.73,10.26 52.12,9.65 50.9,9.65 50.14,10.41 49.38,10.41 R5.2 49.23,10.57 48.77,10.57 47.55,9.35 47.55,8.28 39.62,0.36 21.95,0.36 18.59,3.71 | 18.59,3.71 L1.2
N$26  (via drill 0.35)
  Top 0.152: U$5.2 30.94,15.75 v30.94,13.61 30.94,12.55 C5.2 | R4.2 31.09,2.79 v32.16,2.79 37.34,2.79 38.56,1.58 39.01,1.58 R11.1
  Bottom 0.152: v30.94,13.61 30.94,4.01 v32.16,2.79
N$27
  Top 0.152: Q1.3 83.06,18.19 86.56,18.19 86.87,17.88 R16.2
N$28
  Top 0.152: U$5.6 31.55,20.32 31.55,21.23 31.39,21.39 29.87,21.39 28.19,19.71 28.19,11.79 29.57,10.41 36.27,10.41 36.58,10.11 C11.1
N$29  (via drill 0.35)
  Top 0.152: R19.1 76.2,3.25 76.2,7.06 v75.89,7.37 75.59,7.67 75.59,8.43 SC4503.4 | v90.68,18.64 89.92,19.41 89.31,19.41 84.73,23.98 83.36,23.98 C9.1
  Bottom 0.152: v90.68,18.64 86.87,18.64 75.89,7.67 v75.89,7.37
N$30  (via drill 0.35)
  Top 0.152: 71.02,13.46 71.02,17.42 69.8,18.64 69.49,18.64 | 69.49,18.64 69.19,18.64 C8.2 69.49,18.64 | 69.49,18.64 69.49,21.84 R9.1 | v76.96,12.39 76.81,12.39 76.66,12.24 76.66,11.18 SC4503.2 | v72.54,12.39 71.48,13.46 71.02,13.46 | 71.02,13.46 R18.2
  Bottom 0.152: v72.54,12.39 v76.96,12.39
N$31  (via drill 0.35)
  Top 0.152: v84.73,15.6 83.97,16.36 83.06,16.36 Q1.1 | v90.22,7.52 90.83,6.91 90.83,6.3 R17.2
  Bottom 0.152: v84.73,15.6 86.56,15.6 90.22,11.94 v90.22,7.52
N$32  (via drill 0.35)
  Top 0.152: v77.11,9.96 77.27,9.96 77.57,10.26 77.57,11.02 SC4503.1 | v69.19,7.67 68.12,6.6 65.84,6.6 L4.P$2 | v74.07,11.79 74.07,19.41 D7.A
  Bottom 0.152: 74.07,9.96 71.48,9.96 v69.19,7.67 | 74.07,9.96 v77.11,9.96 | 74.07,9.96 v74.07,11.79
N$36  (via drill 0.35)
  Top 0.152: v79.1,17.73 79.1,18.03 79.25,18.19 80.31,18.19 Q1.4 | v61.87,11.79 61.27,11.18 60.66,11.18 R22.2
  Bottom 0.152: v79.1,17.73 68.58,17.73 62.64,11.79 v61.87,11.79
N$42  (via drill 0.35)
  Top 0.152: v87.63,4.78 88.24,4.17 88.24,3.86 Q5.5 | v84.73,7.06 84.12,7.67 84.12,8.28 C17.1 84.12,8.43 83.82,8.74 82.45,8.74 v79.25,11.94 | v77.11,14.38 75.89,14.38 R23.2
  Bottom 0.152: v87.63,4.78 87.02,4.78 v84.73,7.06 | v77.11,14.38 77.11,14.07 v79.25,11.94
N$43
  Top 0.152: Q7.4 81.53,1.88 81.53,1.73 81.08,1.27 81.23,1.12 82.45,1.12 82.6,1.27 82.6,1.58 82.45,1.73 82.45,1.88 Q7.6
N$44
  Top 0.152: Q7.5 82.14,2.03 82.14,2.34 82.45,2.64 82.75,2.64 82.91,2.79 83.97,1.73 88.09,1.73 88.39,2.03 88.39,2.18 88.24,2.34 88.24,2.64 Q5.2
N$45  (via drill 0.35)
  Top 0.152: v82.45,4.01 82.3,4.01 82.14,3.86 82.14,3.56 81.99,3.4 81.99,3.25 Q7.2 | v87.94,1.12 88.54,1.73 88.7,1.73 88.85,1.88 88.85,2.18 88.7,2.34 88.7,2.64 Q5.3
  Bottom 0.152: v82.45,4.01 85.04,4.01 v87.94,1.12
SELECT  (via drill 0.35)
  Top 0.152: v65.68,22.45 65.99,22.76 65.99,23.52 R1.2 | Q2.1 64.31,14.99 64.31,15.9 v63.86,16.36 61.27,16.36 v50.44,5.54
  Bottom 0.152: v63.86,16.36 63.86,20.62 v65.68,22.45 | v50.44,5.54 49.23,5.54 40.54,14.22 29.72,14.22 26.82,11.33 25.15,11.33 19.51,16.97 19.51,20.78 19.66,20.93 21.03,20.93 21.95,20.02 22.71,20.02 U$2.2
V+  (via drill 0.35)
  Top 0.152: C8.1 69.04,17.12 68.28,17.12 v67.67,17.73 67.67,22.61 68.89,23.83 69.34,23.83 R9.2 69.49,23.67 73.76,23.67 73.91,23.83 D7.C 74.07,23.83 74.83,23.83 75.89,22.76 78.18,22.76 C14.1 | 32.16,19.25 32.31,19.41 32.31,20.17 U$5.5 | 32.16,19.25 32,19.1 30.48,19.1 30.18,19.41 30.18,20.17 U$5.8 | 32.16,19.25 32.31,19.1 32.92,19.1 35.97,16.05 v36.73,16.05 37.8,16.05 C15.1 | Q1.6 80.47,16.2 80.47,12.85 C16.1 80.62,12.7 v80.62,11.48 | v56.08,6.15 55.78,5.84 55.78,4.78 J2.VBUS
  Bottom 0.152: 57.91,6.15 80.47,6.15 83.21,8.89 | 57.91,6.15 v56.08,6.15 49.07,6.15 39.17,16.05 v36.73,16.05 | 83.21,8.89 87.63,13.31 LED3.A | 83.21,8.89 v80.62,11.48 | v67.67,17.73 66.14,17.73 58.67,10.26 58.22,10.26 57.91,9.96 57.91,6.15
VBAT  (via drill 0.35)
  Top 0.152: 69.04,3.71 68.12,2.79 65.84,2.79 L4.P$1 | 69.04,3.71 69.8,4.47 72.24,4.47 C13.1 | 78.03,3.25 78.03,5.23 79.1,6.3 79.1,7.06 R12.2 79.1,7.21 78.18,7.21 77.57,7.82 77.57,8.43 SC4503.5 77.57,8.59 77.57,9.5 78.49,10.41 v78.49,16.2 78.49,18.03 79.55,19.1 81.23,19.1 81.53,18.8 81.53,17.88 81.84,17.58 81.99,17.58 82.3,17.27 82.91,17.27 Q1.2 | v77.11,16.2 75.89,16.2 R23.1 | v79.1,2.64 78.49,3.25 78.03,3.25 | 78.03,3.25 R19.2 78.03,3.1 78.03,2.64 76.81,1.42 71.32,1.42 69.04,3.71
  Bottom 0.152: v78.49,16.2 v77.11,16.2 | v79.1,2.64 81.23,0.51 100.13,0.51 101.35,1.73 102.56,1.73 J1.1

### Text on the board
Top: piezo-rev-3-4 | Jumper | here